# EAGLE design Grill_simple_bord (EAGLE 7.7.0)
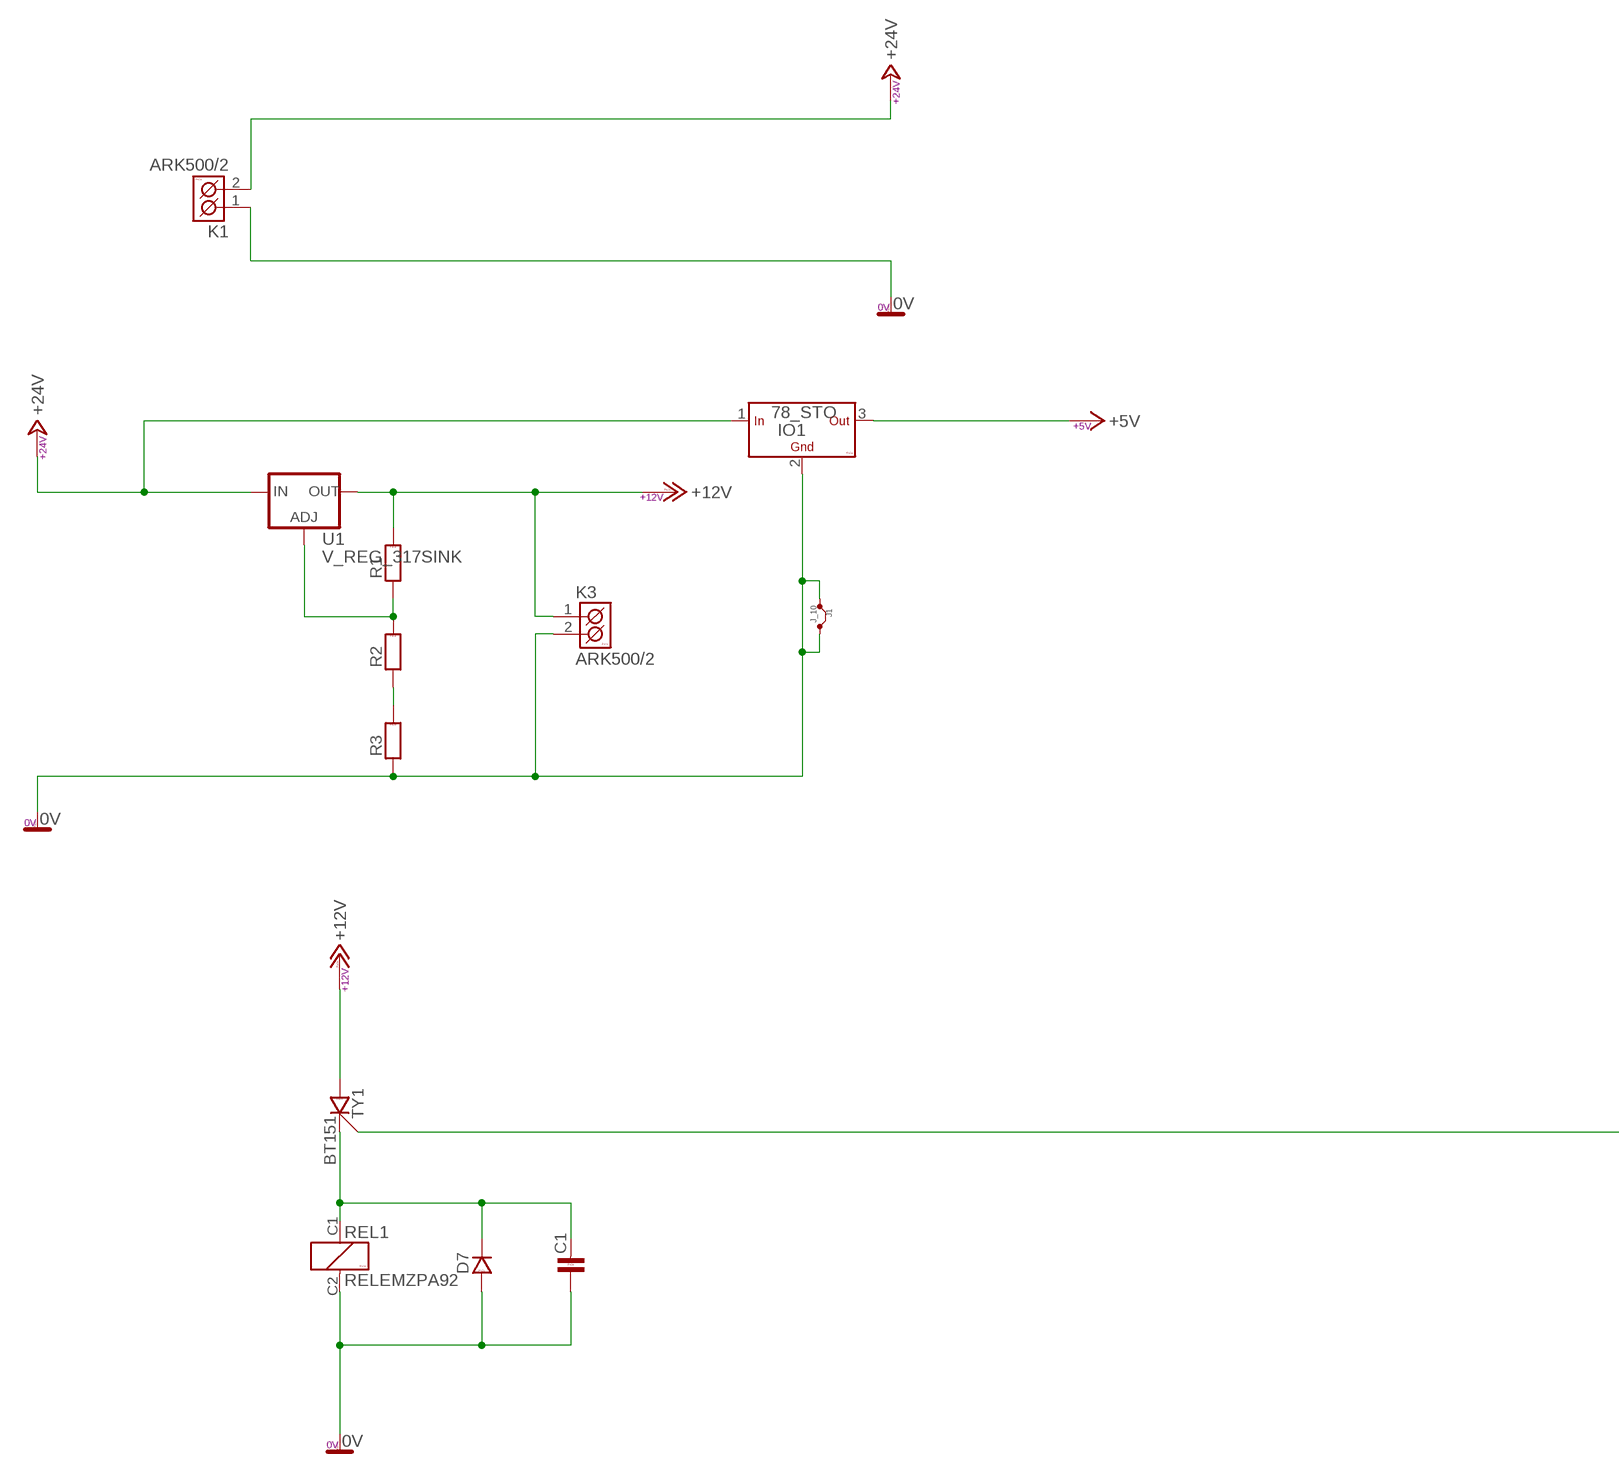
[diagram p0: schematic, sheet 1, part 1 of 2]
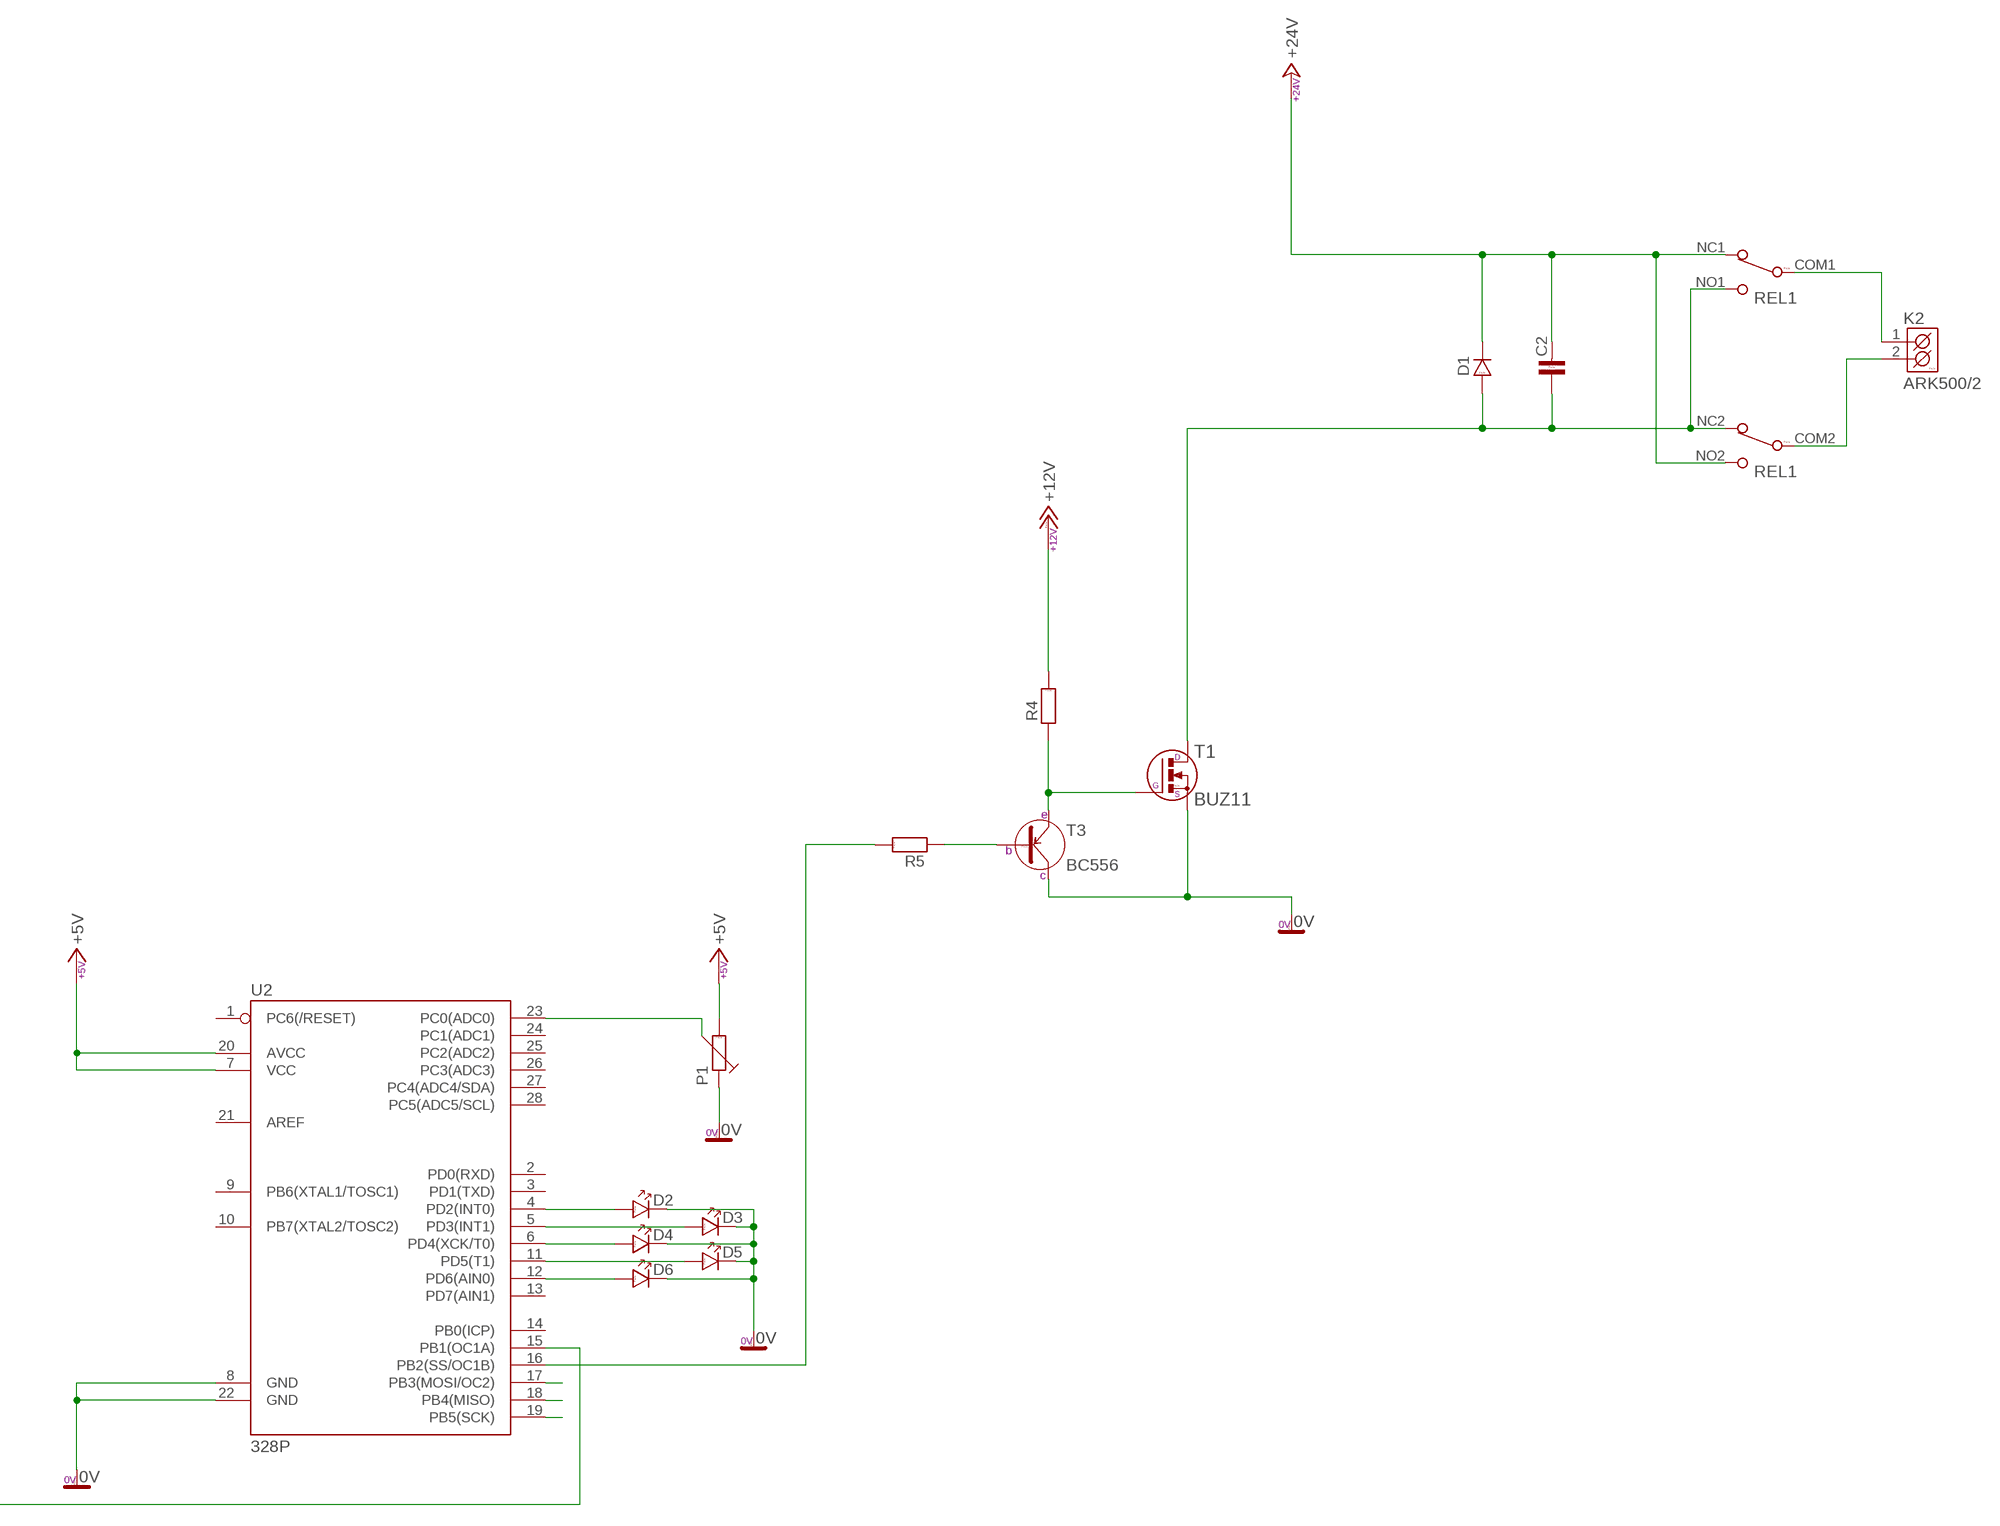
[diagram p1: schematic, sheet 1, part 2 of 2]

## Parts
C1  C-KER_5  [C-5]
C2  C-KER_5  [C-5]
D1  D_10  [DO41]
D2  LED_5  [LED_5]
D3  LED_5  [LED_5]
D4  LED_5  [LED_5]
D5  LED_5  [LED_5]
D6  LED_5  [LED_5]
D7  D_10  [DO41]
IO1  78_STO  [TO-220S]
J1  J_10  [J_10]
K1  ARK500/2  [ARK500/2]
K2  ARK500/2  [ARK500/2]
K3  ARK500/2  [ARK500/2]
P1  TRIMRPT6V  [PT6V]
R1  R_7,5  [R-7,5]
R2  R_7,5  [R-7,5]
R3  R_7,5  [R-7,5]
R4  R_7,5  [R-7,5]
R5  R_7,5  [R-7,5]
REL1  RELEMZPA92  [RELEMZPA92]
T1  BUZ11  [TO-220S]
T3  BC556  [TO-92]
TY1  BT151  [TO-220S]
U1  V_REG_317SINK  [TO220-ADJ]
U2  328P  ATMEGA328P_PDIP  [DIP28]

## Nets
0V: C1.1 D2.K D3.K D4.K D5.K D6.K D7.A IO1.2(GND) J1.P$1 J1.P$2 K1.1(K1) K3.2(K2) P1.1 R3.1 REL1.C2(CIVKA:C2) T1.3(S) T3.1(C) U2.8(GND) U2.22(GND)
+5V: IO1.3(OUT) P1.2 U2.7(VCC) U2.20(AVCC)
+12V: K3.1(K1) R1.2 R4.2 TY1.2(A) U1.OUT
+24V: C2.2 D1.K IO1.1(IN) K1.2(K2) REL1.NC1(PREP1:NC) REL1.NO2(PREP2:NO) U1.IN
N$1: K2.2(K2) REL1.COM2(PREP2:COM)
N$2: R1.1 R2.2 U1.ADJ
N$3: R2.1 R3.2
N$5: U2.19(PB5(SCK))
N$6: K2.1(K1) REL1.COM1(PREP1:COM)
N$7: TY1.3(G) U2.15(PB1(OC1A))
N$8: D2.A U2.4(PD2(INT0))
N$9: C1.2 D7.K REL1.C1(CIVKA:C1) TY1.1(K)
N$10: D3.A U2.5(PD3(INT1))
N$11: R5.1 T3.2(B)
N$12: R4.1 T1.1(G) T3.3(E)
N$13: C2.1 D1.A REL1.NC2(PREP2:NC) REL1.NO1(PREP1:NO) T1.2(D)
N$14: R5.2 U2.16(PB2(SS/OC1B))
N$15: P1.3 U2.23(PC0(ADC0))
N$16: D4.A U2.6(PD4(XCK/T0))
N$17: D5.A U2.11(PD5(T1))
N$18: D6.A U2.12(PD6(AIN0))
N$20: U2.18(PB4(MISO))
N$21: U2.17(PB3(MOSI/OC2))
Unconnected: U2.1(PC6(/RESET)) U2.2(PD0(RXD)) U2.3(PD1(TXD)) U2.9(PB6(XTAL1/TOSC1)) U2.10(PB7(XTAL2/TOSC2)) U2.13(PD7(AIN1)) U2.14(PB0(ICP)) U2.21(AREF) U2.24(PC1(ADC1)) U2.25(PC2(ADC2)) U2.26(PC3(ADC3)) U2.27(PC4(ADC4/SDA)) U2.28(PC5(ADC5/SCL))

## Library data of the parts
C1 C2 = #PaJa_31:C-KER: Kondenzator - keramicky
D1 D7 = #PaJa_31:D: Dioda - univerzální
D2-D6 = #PaJa_31:LED: LED - jednobarevna
IO1 = #PaJa_31:78?: Stabilizator - 1A a 1,5A ? - napeti => 05, 06, 08, 09, 12, 15, 18, 20, 24 => 1,5A ? - napeti => 10, 12, 15, 18 => 1A S ? - napeti => 05, 09, 10, 12, 15, 18, 24 => 2A T ? - napeti => 05 => 3A ------------------------------------------------------- Stabilizator - 100mA (TO-92 , SOT-89) ? - napeti => 02, 05, 06, 08, 09, 12, 15, 18
J1 = #PaJa_31:J_: Bridge - most - 0R
K1-K3 = #PaJa_konektory:ARK500/2: Svorkovnice - roztec 5mm - dvojita
P1 = #PaJa_31:TRIMR: Trimr
R1-R5 = #PaJa_31:R: Rezistor
REL1 = #PaJa_31:RELEMZPA92: RELE - 2x prepinaci, 5V, 12V, 24V max. spinany proud = 5A stejna roztec noh, rozmery (mimo vysku) a zapojeni jako rele RELE4061, RELEF4052 a RELEF4152
T1 = #PaJa_31:BUZ11: N-Channel Enhancement MOSFET 50V; 20A; 0,080Ohm
T3 = #PaJa_31:BC556: Tranzistor PNP - Univerzalni NF - Ic=0,1A
TY1 = #PaJa_31:BT151: Tyristor - 12A
U1 = SparkFun-IC-Power:V_REG_317: Voltage Regulator Standard LM317 adjustable voltage regulator. AOI (Adjust Output Input). Google 'LM317 Calculator' for easy to use app to get the two resistor values needed. 240/720 for 5V output. 240/390 for 3.3V output. Spark Fun Electronics SKU : COM-00527
U2 = SparkFun-IC-Microcontroller:ATMEGA328P_PDIP: Atmel 328P Through hole ATMEGA328P uC used in the Arduino 32kb flash, 1k EEPROM, 2k SRAM Datasheet <http://www.sparkfun.com/datasheets/Components/SMD/ATMega328.pdf> SparkFun Products Storefront component: AVR 28 Pin 20MHz 32K 6A/D - ATMega328P <https://www.sparkfun.com/products/9061> (COM-09061) SparkFun Simon Says - Through-Hole Soldering Kit <https://www.sparkfun.com/products/10547> (KIT-10547) SparkFun Learn to Solder - Simon Says <https://www.sparkfun.com/products/13708> (KIT-13708) SparkFun BigTime Watch Kit <https://www.sparkfun.com/products/11734> (KIT-11734) SparkFun ClockIt <https://www.sparkfun.com/products/10930> (KIT-10930) SparkFun Serial Enabled LCD Kit <https://www.sparkfun.com/products/10097> (LCD-10097) SparkFun Simon Tilts - Through Hole Soldering Kit <https://www.sparkfun.com/products/12634> (KIT-12634) SparkFun Frequency Counter Kit <https://www.sparkfun.com/products/10140> (KIT-10140) FabFM Radio Kit <https://www.sparkfun.com/products/11043> (KIT-11043) SparkFun Binary Blaster Kit <https://www.sparkfun.com/products/12037> (KIT-12037) SparkFun Metro-Gnome <https://www.sparkfun.com/products/9236> (KIT-09236) ATmega328 with Arduino Optiboot (Uno) <https://www.sparkfun.com/products/10524> (DEV-10524); PROD_ID: IC-09136

## Board
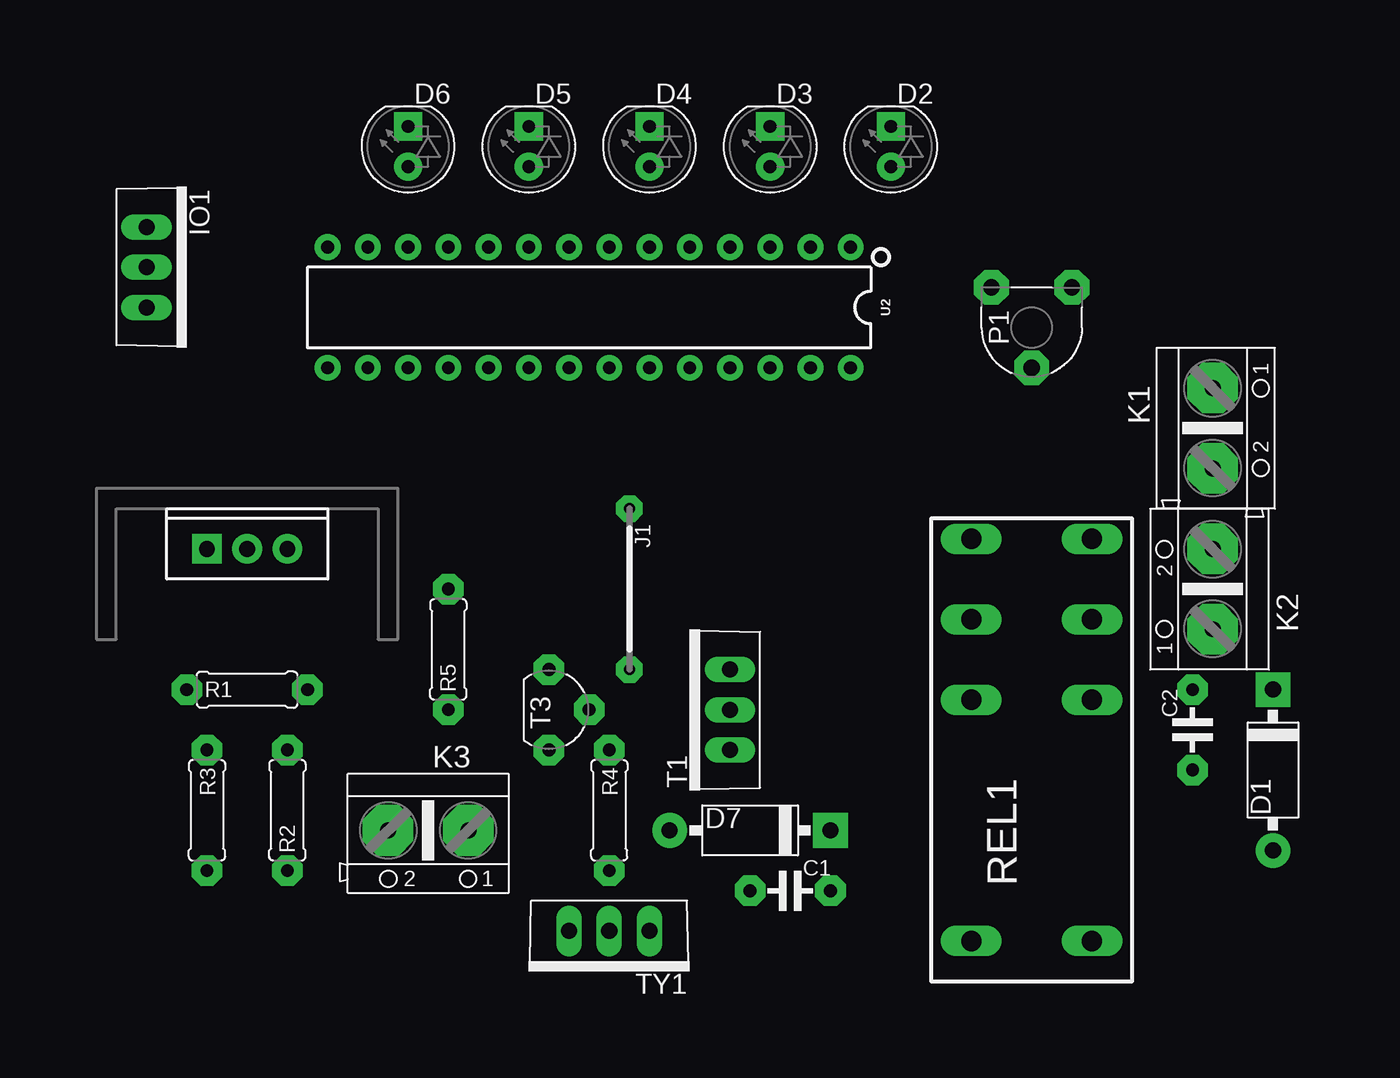
[diagram p2: board, top side]
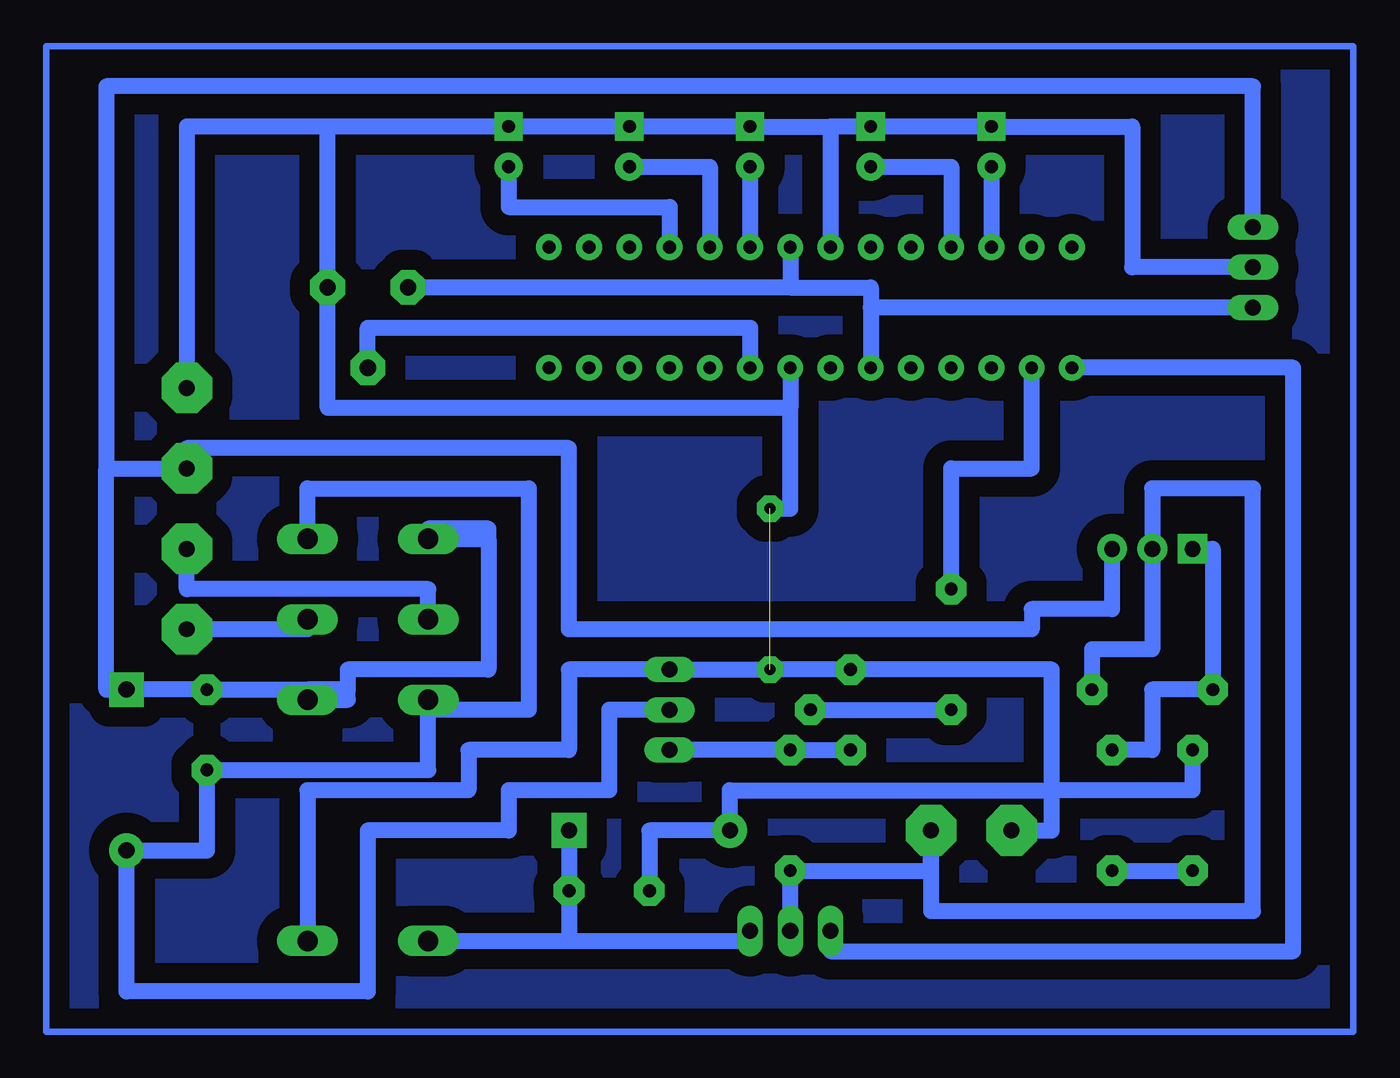
[diagram p3: board, bottom side, seen from below]

No outline drawn. Coordinates in mm, seen from the top.
Copper layers (1*16): Top 0.035mm / dielectric 1.5mm / Bottom 0.035mm
Design rules "default": minimum track width 10mil, minimum drill 24mil, track to track 8mil, track to pad 8mil, pad to pad 8mil, via to via 8mil, smd to smd 8mil, copper to edge 40mil, drill to drill 8mil, minimum pad ring 10mil, minimum via ring 8mil, stop-mask expansion 4mil, vias tented up to drill 0mil, thermal gap 10mil

### Footprints (pad centres in the part's own frame; a part is rotated, then mirrored left to right if it is on the bottom)
C-5 = drill 0.813 pad 1.93 octagon: 1 -2.54,0; 2 2.54,0
DO41 = drill 1.016 pad 2.184: A -5.08,0 | drill 1.016 pad 2.184 square: K 5.08,0
LED_5 = drill 0.813 pad 1.778: A -1.27,0 | drill 0.813 pad 1.778 square: K 1.27,0
TO-220S = drill 1.016 pad 1.6 long: 1 -2.54,0; 2 0,0; 3 2.54,0
J_10 = drill 0.7 pad 1.676 octagon: P$1 -5.08,0; P$2 5.08,0
ARK500/2 = drill 1 pad 3.2 octagon: 1 -2.54,0; 2 2.54,0
PT6V = drill 1.016 pad 2.184 octagon: 1 -2.54,-2.54; 2 2.54,-2.54; 3 0,2.54
R-7,5 = drill 0.813 pad 1.93 octagon: 1 -3.81,0; 2 3.81,0
RELEMZPA92 = drill 1.27 pad 1.93 long: C1 -12.065,3.81; C2 -12.065,-3.81; COM1 8.255,-3.81; COM2 8.255,3.81; NC1 3.175,-3.81; NC2 3.175,3.81; NO1 13.335,-3.81; NO2 13.335,3.81
TO-92 = drill 0.813 pad 1.93 octagon: 1 0,2.54; 2 2.54,0; 3 0,-2.54
TO220-ADJ = drill 1 pad 1.88 square: ADJ -2.54,0 | drill 1 pad 1.88: IN 2.54,0; OUT 0,0
DIP28 = drill 0.813 pad 1.626: 1 -16.51,-3.81; 2 -13.97,-3.81; 3 -11.43,-3.81; 4 -8.89,-3.81; 5 -6.35,-3.81; 6 -3.81,-3.81; 7 -1.27,-3.81; 8 1.27,-3.81; 9 3.81,-3.81; 10 6.35,-3.81; 11 8.89,-3.81; 12 11.43,-3.81; 13 13.97,-3.81; 14 16.51,-3.81; 15 16.51,3.81; 16 13.97,3.81; 17 11.43,3.81; 18 8.89,3.81; 19 6.35,3.81; 20 3.81,3.81; 21 1.27,3.81; 22 -1.27,3.81; 23 -3.81,3.81; 24 -6.35,3.81; 25 -8.89,3.81; 26 -11.43,3.81; 27 -13.97,3.81; 28 -16.51,3.81

### Placement (x,y rotation side)
C1  52.07,7.62 0 top
C2  77.47,17.78 90 top
D1  82.55,15.24 90 top
D2  58.42,54.61 90 top
D3  50.8,54.61 90 top
D4  43.18,54.61 90 top
D5  35.56,54.61 90 top
D6  27.94,54.61 90 top
D7  49.53,11.43 0 top
IO1  11.43,46.99 270 top
J1  41.91,26.67 270 top
K1  78.74,36.83 270 top
K2  78.74,26.67 90 top
K3  29.21,11.43 180 top
P1  67.31,43.18 180 top
R1  17.78,20.32 0 top
R2  20.32,12.7 90 top
R3  15.24,12.7 270 top
R4  40.64,12.7 270 top
R5  30.48,22.86 90 top
REL1  67.31,16.51 90 top
T1  48.26,19.05 90 top
T3  36.83,19.05 0 top
TY1  40.64,5.08 180 top
U1  17.78,29.21 0 top
U2  39.37,44.45 180 top

### Tracks (layer width: path | path; a pad name or v marks a point on that pad's centre or on a via)
0V  (1 unrouted)
  Bottom 1.016: R3.1 15.24,13.97 24.13,13.97 | 24.13,13.97 24.13,21.59 T3.1 J1.P$2 T1.3 54.61,21.59 54.61,16.51 60.96,16.51 60.96,13.97 71.12,13.97 REL1.C2 | K3.2 24.13,11.43 24.13,13.97 | 38.1,55.88 D5.K D6.K 19.05,55.88 19.05,46.99 IO1.2 | 38.1,55.88 D4.K D3.K D2.K 69.85,55.88 | 38.1,55.88 U2.8 | 69.85,55.88 78.74,55.88 K1.1 | 69.85,55.88 P1.1 69.85,38.1 40.64,38.1 | J1.P$1 40.64,31.75 40.64,38.1 | U2.22 40.64,38.1 | 24.13,13.97 44.45,13.97 D7.A 49.53,11.43 C1.1
+5V
  Bottom 1.016: U2.7 40.64,45.72 | 40.64,45.72 P1.2 | 40.64,45.72 35.56,45.72 35.56,44.45 | 35.56,44.45 U2.20 | IO1.3 35.56,44.45
+12V
  Bottom 1.016: TY1.2 R4.2 31.75,8.89 K3.1 31.75,6.35 11.43,6.35 11.43,33.02 17.78,33.02 U1.OUT 17.78,22.86 21.59,22.86 R1.2
+24V
  Bottom 1.016: 71.12,20.32 C2.2 D1.K 83.82,20.32 83.82,34.29 | 71.12,20.32 REL1.NC1 68.58,19.68 68.58,20.32 | 59.69,29.84 59.69,30.48 63.5,30.48 REL1.NO2 59.69,29.84 | 59.69,29.84 59.69,21.59 68.58,21.59 68.58,20.32 | 68.58,20.32 71.12,20.32 | 83.82,34.29 K1.2 78.74,35.56 54.61,35.56 54.61,24.13 25.4,24.13 25.4,25.4 20.32,25.4 U1.IN | IO1.1 11.43,58.42 83.82,58.42 83.82,34.29
N$1
  Bottom 1.016: REL1.COM2 63.5,26.67 78.74,26.67 K2.2
N$2
  Bottom 1.016: U1.ADJ 13.97,29.21 R1.1 17.78,20.32 17.78,16.51 R2.2
N$3
  Bottom 1.016: R2.1 R3.2
N$4
  pour Bottom (isolate 1.27): 5.08,60.96 87.63,60.96 87.63,-1.27 5.08,-1.27
N$6
  Bottom 1.016: REL1.COM1 71.12,24.13 K2.1
N$7
  Bottom 1.016: TY1.3 38.1,3.81 8.89,3.81 8.89,40.64 U2.15
N$8
  Bottom 1.016: D2.A 58.42,50.8 48.26,50.8 U2.4
N$9
  Bottom 1.016: REL1.C1 54.61,4.45 | 54.61,4.45 43.18,4.45 TY1.1 | D7.K C1.2 54.61,4.45
N$10
  Bottom 1.016: D3.A 45.72,53.34 U2.5
N$11
  Bottom 1.016: T3.2 R5.1
N$12
  Bottom 1.016: T1.1 R4.1 T3.3
N$13
  Bottom 1.016: 63.5,19.05 63.5,15.24 C2.1 77.47,10.16 D1.A 82.55,1.27 67.31,1.27 67.31,11.43 58.42,11.43 58.42,13.97 52.07,13.97 52.07,19.05 T1.2 | 63.5,19.05 REL1.NC2 | REL1.NO1 71.12,33.02 57.15,33.02 57.15,19.05 63.5,19.05
N$14
  Bottom 1.016: R5.2 30.48,34.29 25.4,34.29 U2.16
N$15
  Bottom 1.016: P1.3 67.31,43.18 43.18,43.18 U2.23
N$16
  Bottom 1.016: D4.A U2.6
N$17
  Bottom 1.016: D5.A 30.48,53.34 U2.11
N$18
  Bottom 1.016: D6.A U2.12
N$19
  Bottom 0.406: 5.08,-1.27 87.63,-1.27 87.63,60.96 5.08,60.96 5.08,-1.27